# EAGLE design distance (EAGLE 9.2.1)
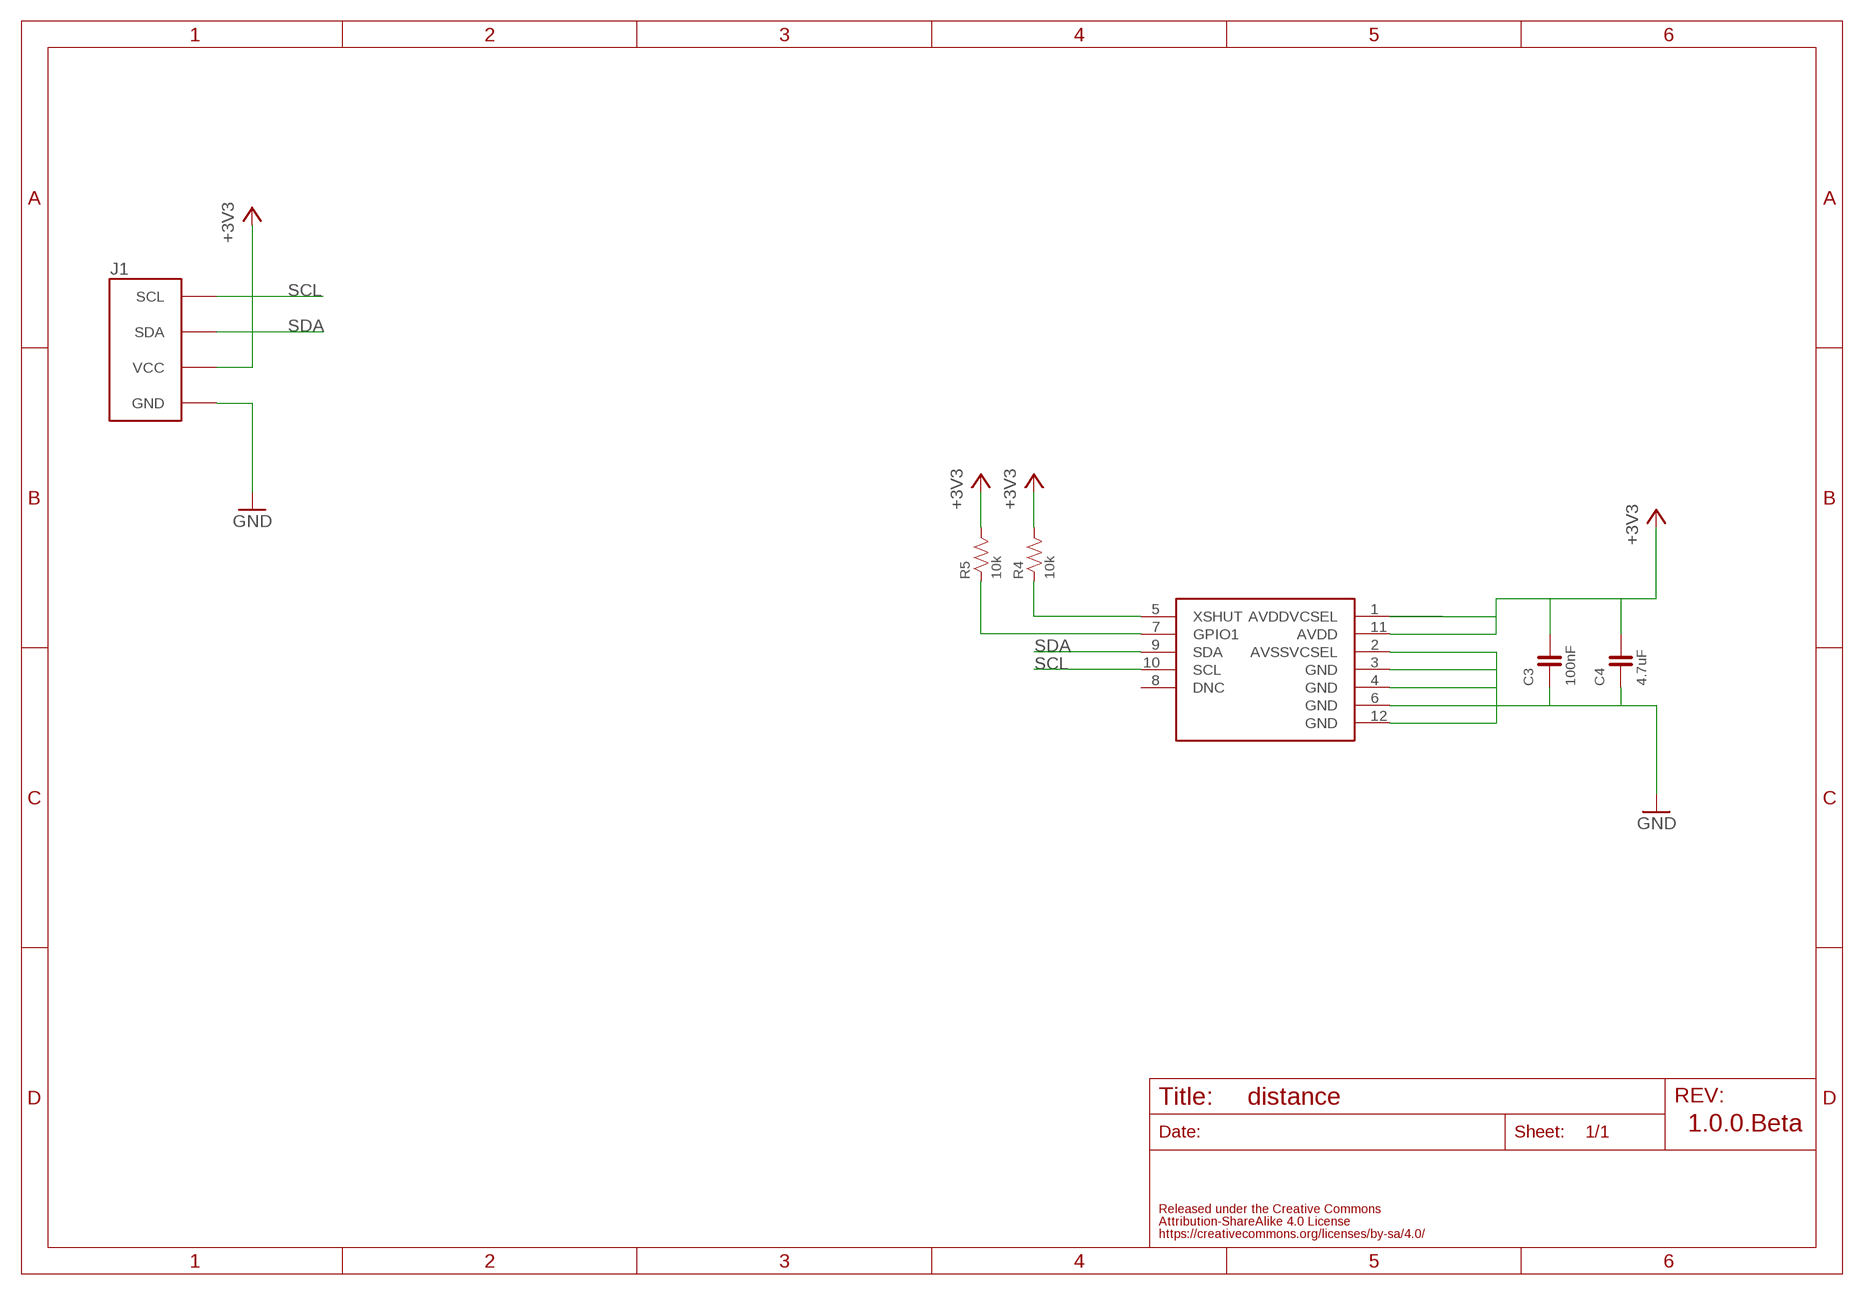
[diagram p0: schematic, sheet 1]

## Parts
C3  100nF  CAPACITOR-0603  [0603]
C4  4.7uF  CAPACITOR-0603  [0603]
J1  FABO_BRICK_I2C-B04B-PASK-1_SILK_BOTTOM  [FABO_BRICK_I2C_B04B-PASK-1_SILK_BOTTOM]
R4  10k  RESISTOR-0603  [0603]
R5  10k  RESISTOR-0603  [0603]
VL1  ST-VL53L0XVL53  [ST-VL53L0X]

## Nets
+3V3: C3.2 C4.2 J1.VCC R4.2 R5.2 VL1.1(AVDDVCSEL) VL1.11(AVDD)
GND: C3.1 C4.1 J1.GND VL1.2(AVSSVCSEL) VL1.3(GND) VL1.4(GND) VL1.6(GND) VL1.12(GND)
N$5: R4.1 VL1.5(XSHUT)
N$6: R5.1 VL1.7(GPIO1)
SCL: J1.SCL VL1.10(SCL)
SDA: J1.SDA VL1.9(SDA)
Unconnected: VL1.8(DNC)

## Notes on the sheet
- 1.0.0.Beta

## Library data of the parts
C3 C4 = FaBo-Capacitor:CAPACITOR: CAPACITOR
J1 = FaBo-Template:FABO_BRICK_I2C: FaBo Brick I2C
R4 R5 = FaBo-Resistors:RESISTOR: RESISTOR
VL1 = FaBo-Mems:ST-VL53L0X

## Board
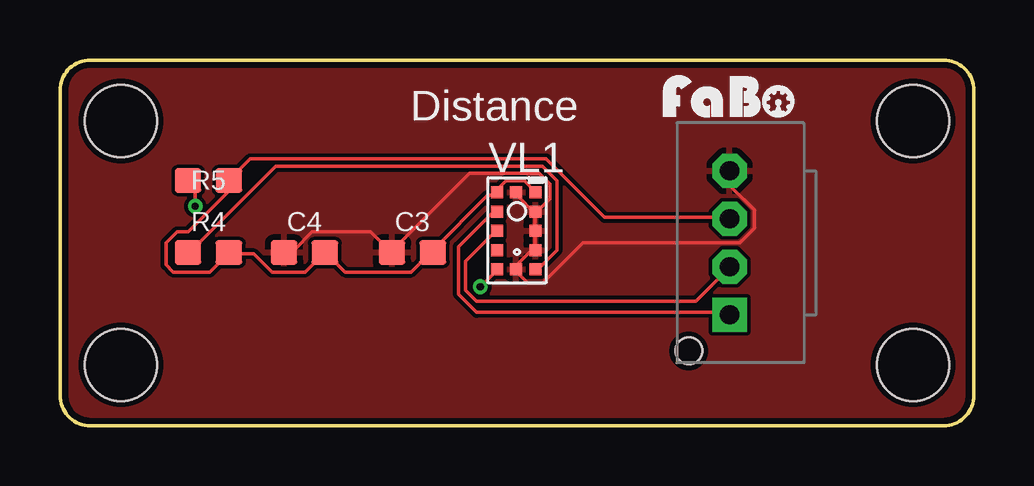
[diagram p1: board, top side]
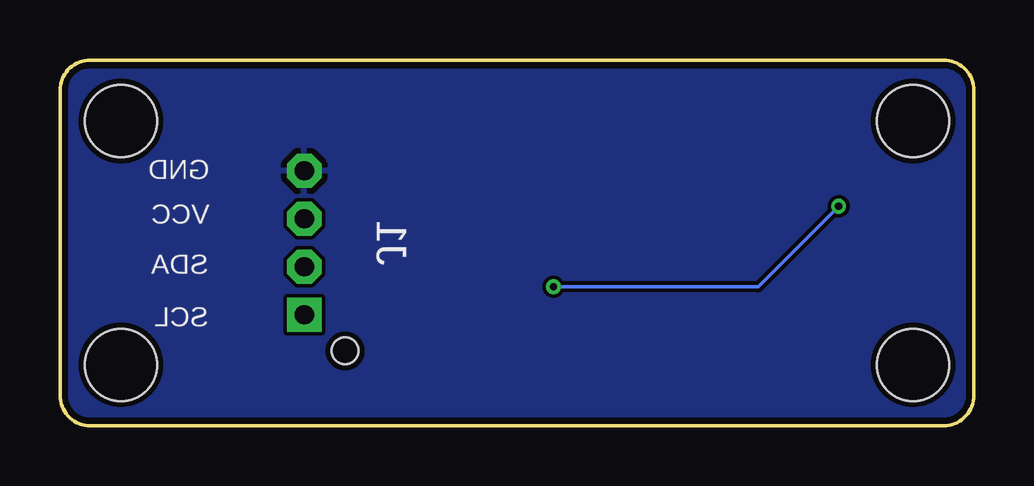
[diagram p2: board, bottom side, seen from below]

Size 38.1 x 15.24 mm. Coordinates in mm from the lower left corner, seen from the top.
Outline: 0,13.97 0,1.27 arc90 1.27,0 36.83,0 arc90 38.1,1.27 38.1,13.97 arc90 36.83,15.24 1.27,15.24 arc90 0,13.97
Copper layers (1*16): Top 0.035mm / dielectric 1.5mm / Bottom 0.035mm
Design rules "SeeedStudio_2layer_DRU_no_angle_20140221": minimum track width 6mil, minimum drill 12mil, track to track 6mil, track to pad 6mil, pad to pad 6mil, via to via 6mil, smd to smd 0mil, copper to edge 10mil, drill to drill 10mil, minimum pad ring 10mil, minimum via ring 6mil, stop-mask expansion 2mil, vias tented up to drill 100mil, thermal gap 10mil
Holes 3 mm at 2.54,12.7 2.54,2.54 35.56,2.54 35.56,12.7

### Footprints (pad centres in the part's own frame; a part is rotated, then mirrored left to right if it is on the bottom)
0603 = smd 1.1 x 1: 1 -0.85,0; 2 0.85,0
FABO_BRICK_I2C_B04B-PASK-1_SILK_BOTTOM = drill 0.8 pad 1.422 octagon: GND 3,0.025; SDA -1,0.025; VCC 1,0.025 | drill 0.8 pad 1.422 square: SCL -3,0.025 | hole 1.1: -4.5,1.725
ST-VL53L0X = smd 0.5 x 0.5: 1 0.77,1.58; 2 0.77,0.78; 3 0.77,-0.02; 4 0.77,-0.82; 5 0.77,-1.62; 6 -0.03,-1.62; 7 -0.83,-1.62; 8 -0.83,-0.82; 9 -0.83,-0.02; 10 -0.83,0.78; 11 -0.83,1.58; 12 -0.03,1.58

### Placement (x,y rotation side)
C3  14.69,7.22 0 top
C4  10.19,7.22 0 top
J1  27.94,7.62 90 top
R4  6.19,7.22 0 top
R5  6.19,10.22 0 top
U$2  [LOGO_FABO_S]  27.94,12.7 0 top
VL1  19.05,8.14 0 top

### Tracks (layer width: path | path; a pad name or v marks a point on that pad's centre or on a via)
+3V3
  Top 0.152: VL1.1 19.81,9.75 19.36,10.21 18.59,10.21 18.29,9.91 18.29,9.75 VL1.11 18.14,9.6 17.83,9.6 15.54,7.32 C3.2 15.39,7.16 14.63,6.4 11.89,6.4 11.12,7.16 C4.2 10.97,7.16 10.21,6.4 8.84,6.4 8.08,7.16 7.16,7.16 R4.2 7.01,7.16 6.25,6.4 4.72,6.4 4.42,6.71 4.42,7.62 4.88,8.08 5.33,8.08 7.01,9.75 7.01,10.21 R5.2 7.16,10.36 7.92,11.12 20.27,11.12 22.71,8.69 27.89,8.69 J1.VCC
GND
  Top 0.152: 19.81,7.47 19.05,6.71 19.05,6.55 VL1.6 19.05,6.4 19.51,5.94 20.12,5.94 21.79,7.62 28.35,7.62 28.96,8.23 28.96,8.99 28.04,9.91 28.04,10.52 J1.GND | 19.81,7.47 19.81,8.08 VL1.3 19.81,8.23 19.81,8.84 | 19.81,7.47 VL1.4 | 19.81,8.84 19.05,9.6 VL1.12 | 19.81,8.84 VL1.2 19.96,8.99 20.42,9.45 20.42,10.06 19.96,10.52 17.07,10.52 13.87,7.32 C3.1 13.72,7.32 12.95,8.08 10.52,8.08 9.75,7.32 9.45,7.32 C4.1
  pour Top: 0,0 0,15.24 38.1,15.24 38.1,0
  pour Bottom: 0,0 0,15.24 38.1,15.24 38.1,0
N$5
  Top 0.152: VL1.5 19.96,6.55 20.73,7.32 20.73,10.21 20.12,10.82 8.99,10.82 5.49,7.32 R4.1
N$6  (via drill 0.3)
  Top 0.152: v17.53,5.79 18.14,6.4 VL1.7 | v5.64,9.14 5.64,10.06 5.49,10.21 R5.1
  Bottom 0.152: v17.53,5.79 8.99,5.79 v5.64,9.14
SCL
  Top 0.152: VL1.10 18.14,8.84 17.98,8.84 16.61,7.47 16.61,5.49 17.37,4.72 27.89,4.72 J1.SCL
SDA
  Top 0.152: VL1.9 18.14,8.08 16.92,6.86 16.92,5.64 17.37,5.18 26.52,5.18 27.89,6.55 J1.SDA

### Text on the board
tPlace: Distance